# EAGLE design ROBIN 3.0 REARRANGED (EAGLE 9.6.2)
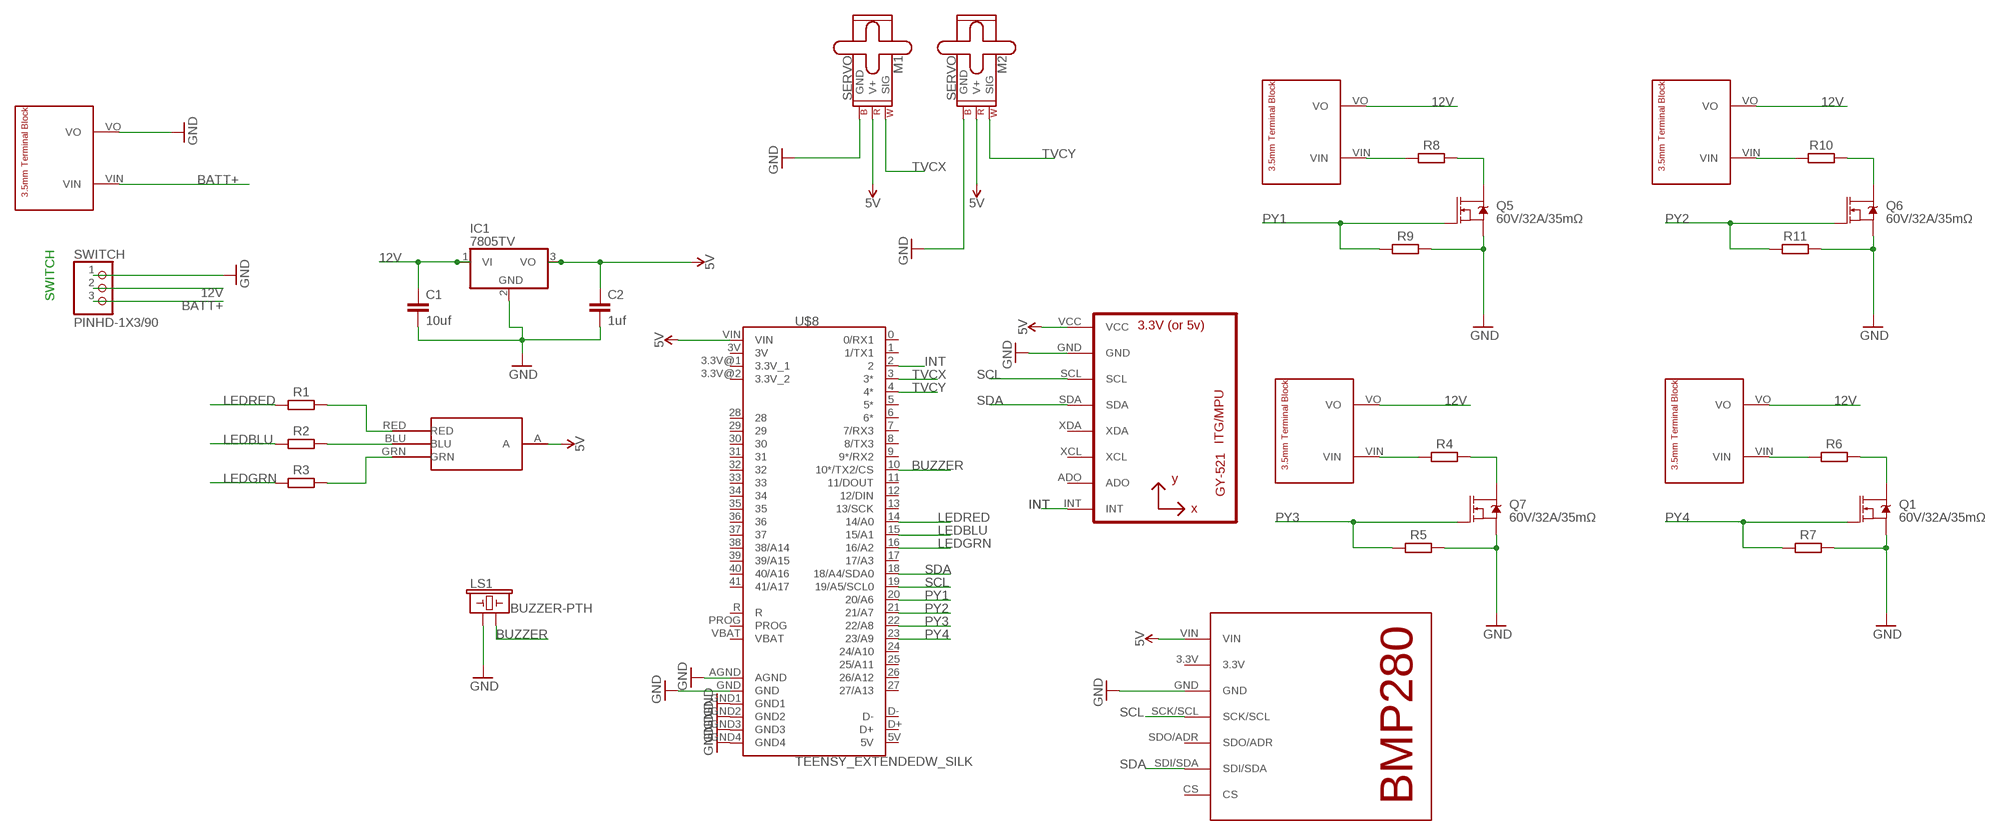
[diagram p0: schematic, sheet 1]

## Parts
C1  10uf  22PF-PTH-2.54MM-200V-5%  [CAP-PTH-2.54]
C2  1uf  22PF-PTH-2.54MM-200V-5%  [CAP-PTH-2.54]
IC1  7805TV  [TO220V]
LS1  BUZZER-PTH  [BUZZER-12MM]
M1  SERVO  [1X03]
M2  SERVO  [1X03]
Q1  60V/32A/35mΩ  MOSFET-NCH-FQP30N06L  [TO220V]
Q5  60V/32A/35mΩ  MOSFET-NCH-FQP30N06L  [TO220V]
Q6  60V/32A/35mΩ  MOSFET-NCH-FQP30N06L  [TO220V]
Q7  60V/32A/35mΩ  MOSFET-NCH-FQP30N06L  [TO220V]
R1  R_AXIAL-7.2MM-PITCH  [RESAD724W46L381D178B]
R2  R_AXIAL-7.2MM-PITCH  [RESAD724W46L381D178B]
R3  R_AXIAL-7.2MM-PITCH  [RESAD724W46L381D178B]
R4  R_AXIAL-7.2MM-PITCH  [RESAD724W46L381D178B]
R5  R_AXIAL-7.2MM-PITCH  [RESAD724W46L381D178B]
R6  R_AXIAL-7.2MM-PITCH  [RESAD724W46L381D178B]
R7  R_AXIAL-7.2MM-PITCH  [RESAD724W46L381D178B]
R8  R_AXIAL-7.2MM-PITCH  [RESAD724W46L381D178B]
R9  R_AXIAL-7.2MM-PITCH  [RESAD724W46L381D178B]
R10  R_AXIAL-7.2MM-PITCH  [RESAD724W46L381D178B]
R11  R_AXIAL-7.2MM-PITCH  [RESAD724W46L381D178B]
SWITCH  PINHD-1X3/90  [1X03/90]
U1  GY-521MPU6050  [GY-521]
U$1  TERMINALBLOCK  [TERMINALBLOCK]
U$2  BMP280  [BMP280]
U$4  TERMINALBLOCK  [TERMINALBLOCK]
U$6  TERMINALBLOCK  [TERMINALBLOCK]
U$7  LEDCA  [LEDCA]
U$8  TEENSY_EXTENDEDW_SILK  [TEENSY_EXTENDED]
U$9  TERMINALBLOCK  [TERMINALBLOCK]
U$10  TERMINALBLOCK  [TERMINALBLOCK]

## Nets
5V: C2.1 IC1.3(VO) M1.2(V+) M2.2(V+) U1.VCC U$2.VIN U$7.A U$8.VIN
12V: C1.1 IC1.1(VI) SWITCH.2 U$4.VO U$6.VO U$9.VO U$10.VO
BATT+: SWITCH.3 U$1.VIN
BUZZER: LS1.- U$8.10(10*/TX2/CS)
GND: C1.2 C2.2 IC1.2(GND) LS1.+ M1.3(GND) M2.3(GND) Q1.3(S) Q5.3(S) Q6.3(S) Q7.3(S) R5.2 R7.2 R9.2 R11.2 SWITCH.1 U1.GND U$1.VO U$2.GND U$8.AGND U$8.GND U$8.GND1 U$8.GND2 U$8.GND3 U$8.GND4
INT: U1.INT U$8.2
LEDBLU: R2.1 U$8.15(15/A1)
LEDGRN: R3.1 U$8.16(16/A2)
LEDRED: R1.1 U$8.14(14/A0)
N$1: R3.2 U$7.GRN
N$2: R2.2 U$7.BLU
N$3: R1.2 U$7.RED
N$4: R6.1 U$4.VIN
N$5: Q1.2(D) R6.2
N$7: R8.1 U$6.VIN
N$8: Q5.2(D) R8.2
N$10: R10.1 U$9.VIN
N$11: Q6.2(D) R10.2
N$13: R4.1 U$10.VIN
N$14: Q7.2(D) R4.2
PY1: Q5.1(G) R9.1 U$8.20(20/A6)
PY2: Q6.1(G) R11.1 U$8.21(21/A7)
PY3: Q7.1(G) R5.1 U$8.22(22/A8)
PY4: Q1.1(G) R7.1 U$8.23(23/A9)
SCL: U1.SCL U$2.SCK/SCL U$8.19(19/A5/SCL0)
SDA: U1.SDA U$2.SDI/SDA U$8.18(18/A4/SDA0)
TVCX: M1.1(SIG) U$8.3(3*)
TVCY: M2.1(SIG) U$8.4(4*)
Unconnected: U1.ADO U1.XCL U1.XDA U$2.3.3V U$2.CS U$2.SDO/ADR U$8.0(0/RX1) U$8.1(1/TX1) U$8.5(5*) U$8.6(6*) U$8.7(7/RX3) U$8.8(8/TX3) U$8.9(9*/RX2) U$8.11(11/DOUT) U$8.12(12/DIN) U$8.13(13/SCK) U$8.17(17/A3) U$8.24(24/A10) U$8.25(25/A11) U$8.26(26/A12) U$8.27(27/A13) U$8.28 U$8.29 U$8.30 U$8.31 U$8.32 U$8.33 U$8.34 U$8.35 U$8.36 U$8.37 U$8.38(38/A14) U$8.39(39/A15) U$8.40(40/A16) U$8.41(41/A17) U$8.PROG U$8.R

## Notes on the sheet
- SWITCH

## Power pins joined to a net without a drawn wire
3.3V_1: U$8.3.3V@1(3.3V_1)
3.3V_2: U$8.3.3V@2(3.3V_2)
3V: U$8.3V
5V: U$8.5V
D+: U$8.D+
D-: U$8.D-
VBAT: U$8.VBAT

## Library data of the parts
C1 C2 = SparkFun-Capacitors:22PF: 22pF ceramic capacitors A capacitor is a passive two-terminal electrical component used to store electrical energy temporarily in an electric field.; PROD_ID: CAP-09128; VALUE: 22pF
IC1 = linear:78*: Positive VOLTAGE REGULATOR Source: http://cache.national.com/ds/LM/LM78L05.pdf http://www.fairchildsemi.com/ds/LM/LM7805.pdf
LS1 = SparkFun-Electromechanical:BUZZER: Buzzer Small round buzzers that operate around the audible 2kHz range. You can use these as speakers to create simple music or user interfaces. Variant Overview: PTH - Mini Speaker - PC Mount 12mm 2.048kHz <https://www.sparkfun.com/products/7950> PTH_KIT - Mini Speaker - PC Mount 12mm 2.048kHz <https://www.sparkfun.com/products/7950> KIT simplifies soldering by adding stop mask to one side of the pads. PTH_NO_SILK - Mini Speaker - PC Mount 12mm 2.048kHz <https://www.sparkfun.com/products/7950> No silkscreen indicator of buzzer outline. PTH_KIT_NO_SILK - Mini Speaker - PC Mount 12mm 2.048kHz <https://www.sparkfun.com/products/7950> KIT package w/o silkscreen SMD - Buzzer Audio Magnetic (CCV-084B16) SMD buzzer used on, e.g. the LilyPad Buzzer <https://www.sparkfun.com/products/8463> and RFID USB Reader <https://www.sparkfun.com/products/9963>. SMD_KIT - Buzzer Audio Magnetic (CCV-084B16) SMD Buzzer with elongated pins to make soldering easier. Used on the SparkFun Simon Says - Surface Mount Soldering Kit <https://www.sparkfun.com/products/10935>.; PROD_ID: COMP-08253; SF_SKU: COM-07950
M1 M2 = SparkFun-Electromechanical:SERVO: Servo Motor 3-pin connector for a standard servo motor (voltage supply, ground, and control signal.) SparkFun Products Servo - Generic (Sub-Micro Size) <https://www.sparkfun.com/products/9065> (ROB-09065) Servo - Generic High Torque Continuous Rotation (Standard Size) <https://www.sparkfun.com/products/9347> (ROB-09347) Servo - Generic High Torque (Standard Size) <https://www.sparkfun.com/products/11965> (ROB-11965)
Q1 Q5-Q7 = SparkFun-DiscreteSemi:MOSFET-NCH: N-channel MOSFETs Voltage controlled devices that allow control of high current outputs. SparkFun Products: SparkFun OpenScale <https://www.sparkfun.com/products/13261> SparkFun Digital Sandbox <https://www.sparkfun.com/products/12651> SparkFun Monster Moto Shield <https://www.sparkfun.com/products/10182> SparkFun MOSFET Power Controller <https://www.sparkfun.com/products/11214>; PROD_ID: TRANS-10060
R1-R11 = Resistor AHHH3:R: Resistor Fixed - Generic; CATEGORY: Resistor; SUB-CATEGORY: Fixed
SWITCH = Connector:PINHD-1X3: PIN HEADER; CATEGORY: CONNECTOR; SUB-CATEGORY: PIN-HEADER
U1 = gy-521:GY-521
U$1 U$4 U$6 U$9 U$10 = Terminal Block 2 pins 3.5mm:TERMINALBLOCK
U$2 = BMP280:BMP280
U$7 = LEDCA:LEDCA
U$8 = SparkFun-Boards:TEENSY_EXTENDED: Teensy Footprint Extended Mechanical footprint with connectors for Teensy Development Board with ARM Cortex. SparkFun Products: Teensy 4.1 <https://www.sparkfun.com/products/16771> Teensy 3.6 <https://www.sparkfun.com/products/14057> Teensy 3.5 <https://www.sparkfun.com/products/14055> SparkFun Qwiic Shield for Teensy Extended <https://www.sparkfun.com/products/17156> Teensy Stackable Header Kit (Longer Version) <https://www.sparkfun.com/products/17152>

## Board
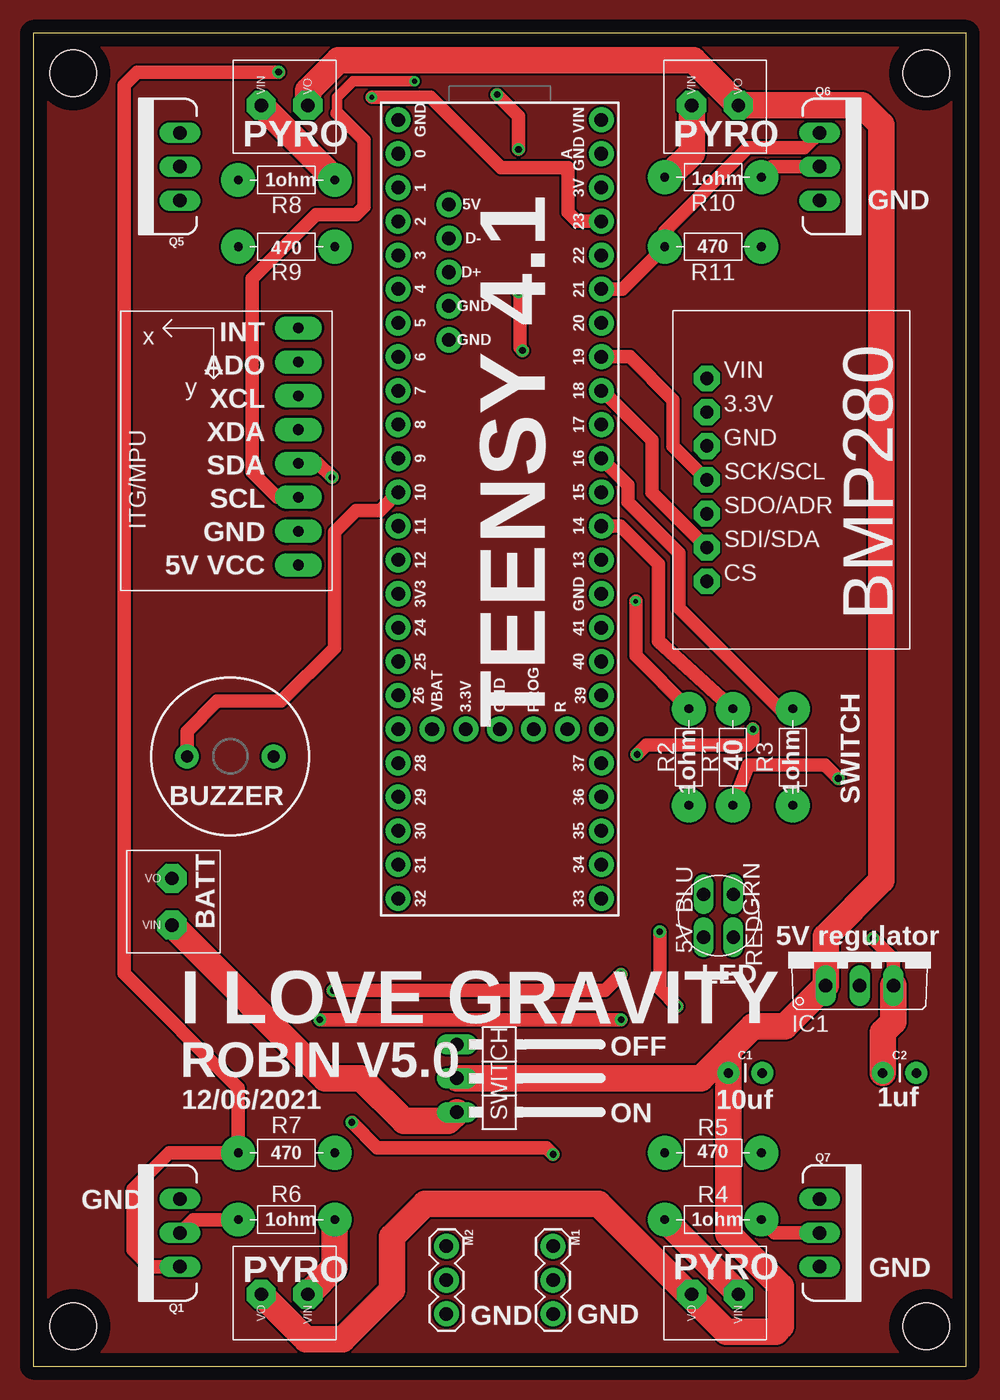
[diagram p1: board, top side]
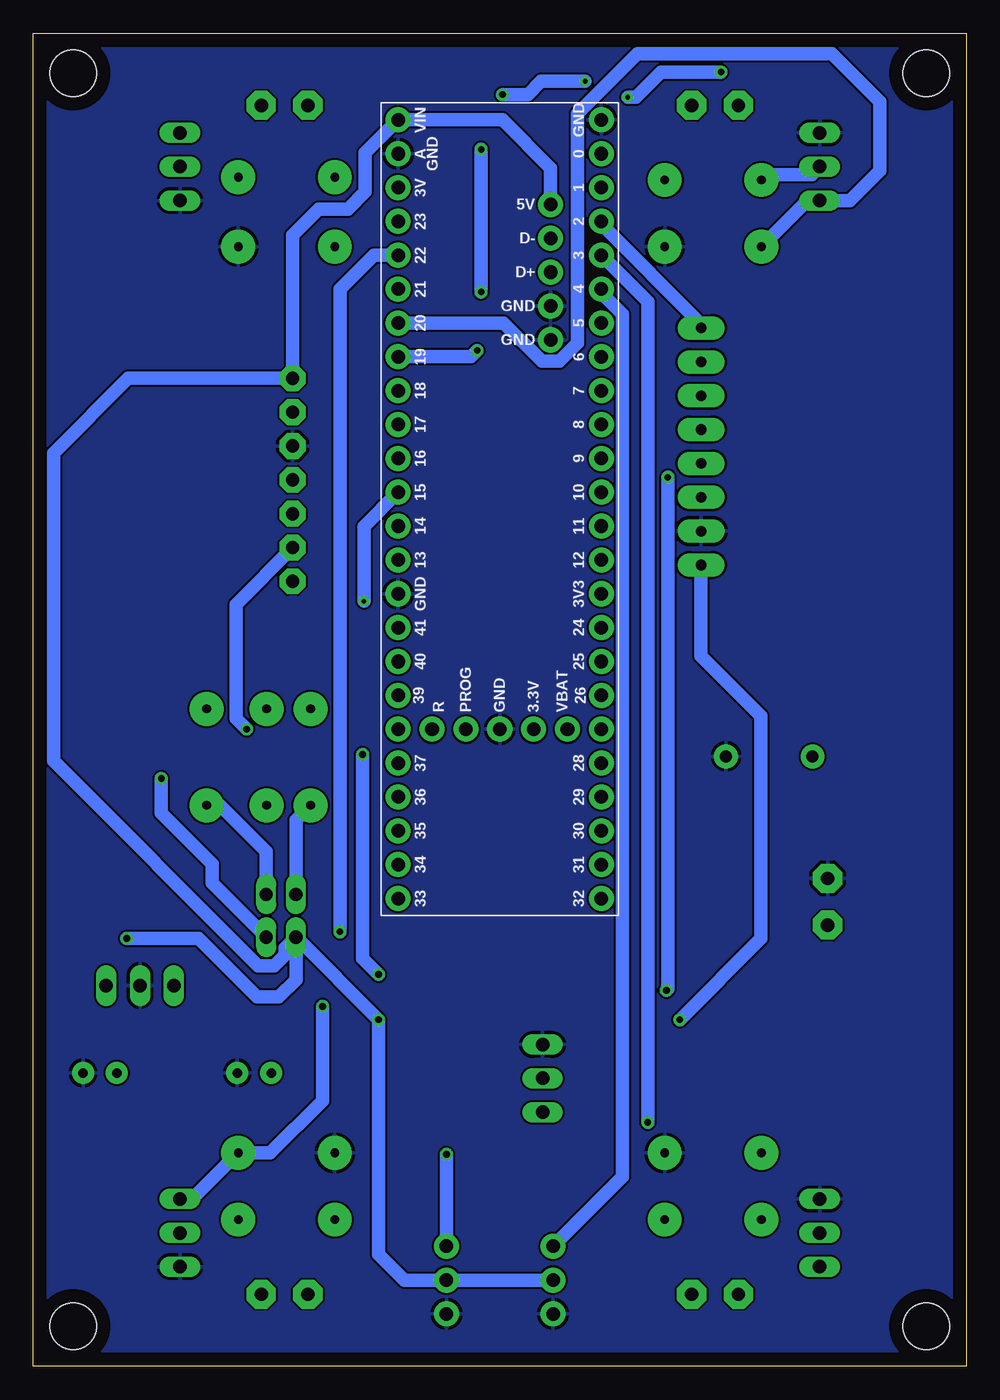
[diagram p2: board, bottom side, seen from below]

Size 70 x 100 mm. Coordinates in mm from the lower left corner, seen from the top.
Outline: 0,100 0,0 70,0 70,100 0,100
Copper layers (1*16): Top 0.035mm / dielectric 1.5mm / Bottom 0.035mm
Design rules "default": minimum track width 6mil, minimum drill 0.35mm, track to track 6mil, track to pad 6mil, pad to pad 6mil, via to via 6mil, smd to smd 6mil, copper to edge 40mil, drill to drill 6mil, minimum pad ring 10mil, minimum via ring 8mil, stop-mask expansion 4mil, vias tented up to drill 0mil, thermal gap 10mil
Holes 3.5 mm at 3,97 3,3 67,97 67,3

### Footprints (pad centres in the part's own frame; a part is rotated, then mirrored left to right if it is on the bottom)
CAP-PTH-2.54 = drill 0.7 pad 1.651: 1 -1.27,0; 2 1.27,0
TO220V = drill 1.016 long: 1 -2.54,-2.54; 2 0,-2.54; 3 2.54,-2.54
BUZZER-12MM = drill 0.9 pad 1.778: + 3.25,0; - -3.25,0
1X03 = drill 1.016 pad 1.88: 1 0,0; 2 2.54,0; 3 5.08,0
TO220V' = drill 1.016 long: 1 -2.54,0; 2 0,0; 3 2.54,0
RESAD724W46L381D178B = drill 0.66 pad 2.54: 1 -3.62,0; 2 3.62,0
1X03/90 = drill 1.016 long: 1 -2.54,-3.81; 2 0,-3.81; 3 2.54,-3.81
GY-521 = drill 0.8 pad 1.778 long: ADO -8.89,-6.35; GND -8.89,6.35; INT -8.89,-8.89; SCL -8.89,3.81; SDA -8.89,1.27; VCC -8.89,8.89; XCL -8.89,-3.81; XDA -8.89,-1.27
TERMINALBLOCK = drill 1 pad 2.184 octagon: VIN 2.1,3.6; VO 5.6,3.6
BMP280 = drill 1 pad 1.93 octagon: 3.3V 7.62,2.54; CS 20.32,2.54; GND 10.16,2.54; SCK/SCL 12.7,2.54; SDI/SDA 17.78,2.54; SDO/ADR 15.24,2.54; VIN 5.08,2.54
LEDCA = drill 1 long: A -1.1,-1.6; BLU -1.1,1.6; GRN 1.13,1.6; RED 1.13,-1.6
TEENSY_EXTENDED = drill 1.016 pad 1.88: 0 7.62,-13.97; 1 7.62,-11.43; 2 7.62,-8.89; 3 7.62,-6.35; 3.3V@1 7.62,19.05; 3.3V@2 2.54,29.21; 3V -7.62,-11.43; 4 7.62,-3.81; 5 7.62,-1.27; 5V 3.81,-10.16; 6 7.62,1.27; 7 7.62,3.81; 8 7.62,6.35; 9 7.62,8.89; 10 7.62,11.43; 11 7.62,13.97; 12 7.62,16.51; 13 -7.62,16.51; 14 -7.62,13.97; 15 -7.62,11.43; 16 -7.62,8.89; 17 -7.62,6.35; 18 -7.62,3.81; 19 -7.62,1.27; 20 -7.62,-1.27; 21 -7.62,-3.81; 22 -7.62,-6.35; 23 -7.62,-8.89; 24 7.62,21.59; 25 7.62,24.13; 26 7.62,26.67; 27 7.62,29.21; 28 7.62,31.75; 29 7.62,34.29; 30 7.62,36.83; 31 7.62,39.37; 32 7.62,41.91; 33 -7.62,41.91; 34 -7.62,39.37; 35 -7.62,36.83; 36 -7.62,34.29; 37 -7.62,31.75; 38 -7.62,29.21; 39 -7.62,26.67; 40 -7.62,24.13; 41 -7.62,21.59; AGND -7.62,-13.97; D+ 3.81,-5.08; D- 3.81,-7.62; GND 0,29.21; GND1 7.62,-16.51; GND2 -7.62,19.05; GND3 3.81,-2.54; GND4 3.81,0; PROG -2.54,29.21; R -5.08,29.21; VBAT 5.08,29.21; VIN -7.62,-16.51

### Placement (x,y rotation side)
C1  53.42,22 0 top
C2  65,22 0 top
IC1  62,31.1 0 top
LS1  14.78,45.75 0 top
M1  39,9 270 top
M2  31,9 270 top
Q1  60V/32A/35mΩ  [TO220V']  11,10 90 top
Q5  60V/32A/35mΩ  [TO220V']  11,90 90 top
Q6  60V/32A/35mΩ  [TO220V']  59,90 270 top
Q7  60V/32A/35mΩ  [TO220V']  59,10 270 top
R1  52.5,45.7 270 top
R2  49.2,45.7 270 top
R3  57,45.7 270 top
R4  51,11 0 top
R5  51,16 180 top
R6  19,11 180 top
R7  19,16 0 top
R8  19,89 180 top
R9  19,84 0 top
R10  51,89.2 0 top
R11  51,84 0 top
SWITCH  35.6,21.6 270 top
U1  11,69 180 top
U$1  14,31 90 top
U$2  48,79.2 270 top
U$4  22.7,9 180 top
U$6  15,91 0 top
U$7  51.4,33.8 0 top
U$8  35,77 180 top
U$9  47.3,91 0 top
U$10  55,9 180 top

### Tracks (layer width: path | path; a pad name or v marks a point on that pad's centre or on a via)
3.3V
  pour Top: -6,104 76,104 76,-5 -3,-5 -6,-2
5V  (via drill 0.5)
  Top 1: IC1.3 64.54,30.56 v63,32.1 | v21.5,26 v44.1,26
  Top 2: IC1.3 64.54,25.84 63.73,25.03 C2.1
  Bottom 1: v63,32.1 57.6,32.1 53.2,27.7 51.6,27.7 50.3,29 U$7.A | U$7.A 51.12,31.38 51.12,30.86 51.95,30.04 53.11,30.04 68.48,45.41 68.48,68.5 62.86,74.12 U$2.VIN 50.54,84.86 48.6,86.8 46.4,86.8 45.1,88.1 45.1,91.03 U$8.VIN 34.81,93.51 31.19,89.89 U$8.5V | U$7.A v44.1,26 44.1,8.4 42.16,6.46 M1.2 M2.2 | U1.VCC 19.89,53.29 15.4,48.8 15.4,32.1 v21.5,26
12V
  Top 2: U$6.VO 20.6,95.68 22.9,97.98 49.52,97.98 U$9.VO 62.16,94.6 63.63,93.13 63.63,36.43 59.46,32.26 IC1.1 56.4,25.5 54,25.5 52.15,23.65 | U$4.VO 20.48,2.02 23.2,2.02 26.9,5.72 26.9,9.7 29.4,12.2 42.4,12.2 49.2,5.4 | 49.2,5.4 U$10.VO | 52.15,23.65 C1.1 52.15,9.95 56.1,6 56.1,3 55.7,2.6 52,2.6 49.2,5.4 | SWITCH.2 50.1,21.6 52.15,23.65
BATT+
  Top 2: SWITCH.3 31.13,18.4 27.8,18.4 24.6,21.6 21.9,21.6 U$1.VIN
BUZZER
  Top 1: U$8.10 26.01,64.2 24.2,64.2 22.6,62.6 22.6,53.9 18.6,49.9 13.8,49.9 11.53,47.63 LS1.-
GND
  pour Bottom: -2,101 73,101 74,100 74,-3 -3,-3 -5,-1 -5,98
INT
  Bottom 1: U$8.2 27.38,85.69 19.89,78.2 U1.INT
LEDBLU  (via drill 0.35)
  Top 1: R2.1 45.2,53.32 v45.2,57.4
  Bottom 1: v45.2,57.4 45.2,62.99 U$8.15
LEDGRN
  Top 1: U$8.16 44.62,66.11 44.62,64.82 48.45,60.99 48.45,56.87 56,49.32 R3.1
LEDRED
  Top 1: U$8.14 44.07,63.03 46.9,60.2 46.9,54.42 R1.1
N$1
  Bottom 1: U$7.GRN 52.53,38.61 56,42.08 R3.2
N$2
  Bottom 1: R2.2 50.3,40.98 U$7.BLU
N$3  (via drill 0.5)
  Top 1: R1.2 53.66,45.1 59.4,45.1 v60.4,44.1
  Bottom 1: U$7.RED 56.6,36.27 56.6,37.7 60.4,41.5 v60.4,44.1
N$4
  Top 2: U$4.VIN 22.62,7.42 R6.1
N$5
  Top 1: Q1.2 12,11 R6.2
N$7
  Top 2: U$6.VIN 22.62,89.08 R8.1
N$8
  Bottom 1: Q5.2 11.6,89.4 14.98,89.4 R8.2
N$10
  Top 2: U$9.VIN 49.4,91.02 47.58,89.2 R10.1
N$11
  Top 1: R10.2 55.42,90 Q6.2
N$13
  Top 2: R4.1 52.9,5.48 U$10.VIN
N$14
  Top 1: Q7.2 55.62,10 R4.2
PY1
  Bottom 1: U$8.20 34.71,78.27 31.85,75.41 30.53,75.41 29.17,76.77 29.17,93.97 24.66,98.48 10.1,98.48 6.5,94.88 6.5,89.7 8.74,87.46 Q5.1 11.92,87.46 R9.1
PY2
  Top 1: Q6.1 57.87,91.41 53.62,91.41 47.38,85.17 R11.1 44.19,80.81 U$8.21
PY3  (via drill 0.5)
  Top 1: v48.3,27 47,28.3 v47,32.6
  Bottom 1: v48.3,27 48.3,19.92 52.22,16 R5.1 58.08,12.54 Q7.1 | v47,32.6 47,80.8 44.45,83.35 U$8.22
PY4  (via drill 0.35, 0.5)
  Top 1: Q1.1 8.74,7.46 7.5,8.7 7.5,13.3 10.2,16 R7.1 15.38,20.9 6.82,29.46 6.82,96.12 7.8,97.1 v18.4,97.1 | U$8.23 40.81,85.89 40.1,86.6 40.1,89.9 35.1,89.9 29.8,95.2 v25.4,95.2
  Bottom 1: v25.4,95.2 24.8,95.2 22.9,97.1 v18.4,97.1
SCL  (via drill 0.35, 0.5)
  Top 0.8: v28.6,96.4 24,96.4 22.8,95.2 22.8,94
  Top 1: U$2.SCK/SCL 48,69.04 48,72.5 44.77,75.73 U$8.19 | v36.7,76.2 36.5,76.4 36.5,80.5 v36.4,80.6 | U1.SCL 18.31,65.19 16.4,67.1 16.4,81.6 21.2,86.4 24.2,86.4 24.8,87 24.8,92 22.8,94 | v34.8,95.4 36.4,93.8 v36.4,91.3
  Bottom 1: U$8.19 37.17,75.73 v36.7,76.2 | v34.8,95.4 32.9,95.4 31.9,96.4 v28.6,96.4 | v36.4,91.3 v36.4,80.6
SDA  (via drill 0.5)
  Top 1: U$2.SDI/SDA 46.4,65.56 46.4,69.5 42.71,73.19 U$8.18 | U1.SDA 21.37,67.73 v22.4,66.7 | v22.5,28.2 42.9,28.2 v44.1,29.4 | v45.3,45.9 46,46.6 53.6,46.6 54,47 v54,47.8
  Bottom 1: v22.4,66.7 22.4,28.3 v22.5,28.2 | v44.1,29.4 45.3,30.6 v45.3,45.9 | v54,47.8 54.8,48.6 54.8,57.16 U$2.SDI/SDA
TVCX  (via drill 0.5)
  Top 1: v23.9,18.3 25.8,16.4 38.5,16.4 v39,15.9
  Bottom 1: U$8.3 23.9,79.87 v23.9,18.3 | v39,15.9 M1.1
TVCY
  Bottom 1: U$8.4 27.38,80.52 25.79,78.93 25.79,14.21 M2.1

### Text on the board
tPlace: PYRO | PYRO | 1ohm | 1ohm | GND | 470 | 470 | INT | ADO | XCL | XDA | SDA | SCL | GND | 5V VCC | TEENSY 4.1 | 1ohm | 1ohm | 40 | BUZZER | SWITCH | BATT | 5V regulator | LED | I LOVE GRAVITY | OFF | ROBIN V5.0 | 1uf | 12/06/2021 | 10uf | ON | 470 | 470 | GND | 1ohm | 1ohm | GND | PYRO | PYRO | GND | GND